# Altium schematic sheet WheelMotor.SchDoc
size A4
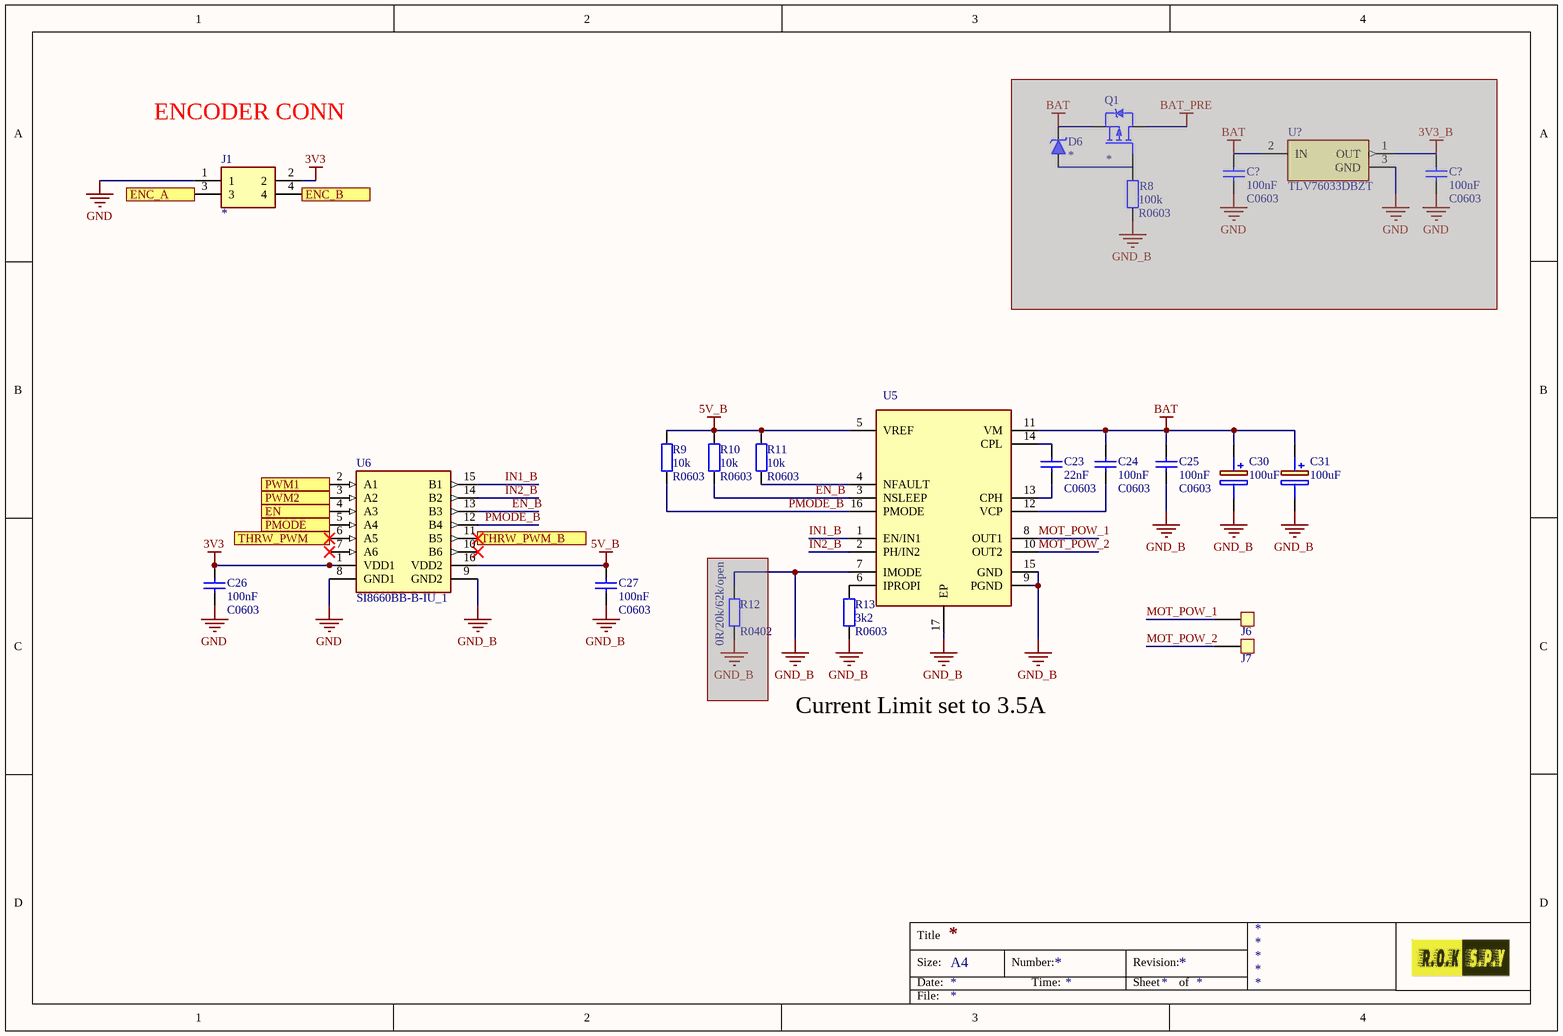
[diagram p0: WheelMotor.SchDoc]

## Parts
(Parts that share a designator on the sheet are numbered #1, #2 ... from top to bottom, then left to right.)
C23  Capacitance: 22nF  [C0603]
C24  Capacitance: 100nF  [C0603]
C25  Capacitance: 100nF  [C0603]
C26  Capacitance: 100nF  [C0603]
C27  Capacitance: 100nF  [C0603]
C30  100uF  [CAPPRD250W55D630H1220]
C31  100uF  [CAPPRD250W55D630H1220]
C?#1  Capacitance: 100nF  [C0603]  (masked out: inside a compile mask, not in the netlist)
C?#2  Capacitance: 100nF  [C0603]  (masked out: inside a compile mask, not in the netlist)
D6  *  (masked out: inside a compile mask, not in the netlist)
J1  215079-4  [TE_215079-4]  (value not drawn)
J6  Connection_pad  [Wire_Pad]  (value not drawn)
J7  Connection_pad  [Wire_Pad]  (value not drawn)
Q1  *  (masked out: inside a compile mask, not in the netlist)
R8  100k  [R0603]  (masked out: inside a compile mask, not in the netlist)
R9  10k  [R0603]
R10  10k  [R0603]
R11  10k  [R0603]
R12  0R/20k/62k/open  [R0402]  (masked out: inside a compile mask, not in the netlist)
R13  3k2  [R0603]
U5  DRV8874PWPR  [SOP65P640X120-17N]  (value not drawn)
U6  SI8660BB-B-IU_1  [SOP64P600X175-16N]
U?  TLV76033DBZT  [SOT23]  (masked out: inside a compile mask, not in the netlist)

## Ports
EN (in), ENC_A (out), ENC_B (out), PMODE (in), PWM1 (in), PWM2 (in), THRW_PWM (in), THRW_PWM_B (out)

## Nets
3V3: C26.2 J1.2 U6.1(VDD1)
5V_B: C27.2 R9.2 R10.2 R11.2 U5.5(VREF) U6.16(VDD2)
BAT: C24.2 C25.2 C30.1(+) C31.1(+) U5.11(VM)
GND: C26.1 J1.1 U6.8(GND1)
GND_B: C25.1 C27.1 C30.2(-) C31.2(-) R13.1 U5.7(IMODE) U5.9(PGND) U5.15(GND) U5.17(EP) U6.9(GND2)
EN: U6.4(A3) ; port EN
EN_B: R10.1 U5.3(NSLEEP) U6.13(B3)
ENC_A: J1.3 ; port ENC_A
ENC_B: J1.4 ; port ENC_B
IN1_B: U5.1(EN/IN1) U6.15(B1)
IN2_B: U5.2(PH/IN2) U6.14(B2)
MOT_POW_1: J6.1 U5.8(OUT1)
MOT_POW_2: J7.1 U5.10(OUT2)
PMODE: U6.5(A4) ; port PMODE
PMODE_B: R9.1 U5.16(PMODE) U6.12(B4)
PWM1: U6.2(A1) ; port PWM1
PWM2: U6.3(A2) ; port PWM2
THRW_PWM: U6.6(A5) ; port THRW_PWM
THRW_PWM_B: U6.11(B5) ; port THRW_PWM_B
NetC23_1: C23.1 U5.13(CPH)
NetC23_2: C23.2 U5.14(CPL)
NetC24_1: C24.1 U5.12(VCP)
NetR11_1: R11.1 U5.4(NFAULT)
NetR13_2: R13.2 U5.6(IPROPI)

Not connected (* = marked no-connect by the designer): U6 7(A6)* 10(B6)*

## Notes on the sheet
- ENCODER CONN
- Current Limit set to 3.5A
- Title
- Size:
- Date:
- A4
- Number:
- Time:
- Revision:
- Sheet
- of
- File:

## Library data of the parts
C23-C27 C?#1 C?#2 = Capacitor: Ceramic capacitor; Type: MLCC; Voltage rating: *V; ComponentLinknDescription: Datasheet; Characteristic: *; Manufacturer: *; ComponentLinknURL: *; Note: C0603
C30 C31 = EEUFC1E101S: Capacitor Polarised; Datasheet Link: *; Height: *; Manufacturer_Name: *; Manufacturer_Part_Number: *; Capacitance: 100uF; Voltage Rating: *; Farnell Order Nr: *
D6 = Zenner Diode: PartNumber: *; Parameter 2: *; Parameter 3: *; Parameter 4: *; Farnell Order Nr: *; Zenner Voltage: *
J1 = 215079-4: 4 Position Receptacle Connector Through Hole; MF: TE Connectivity; Price: None; Availability: Unavailable; SnapEDA_Link: https://www.snapeda.com/parts/215079-4/TE%20Connectivity%20AMP%20Connectors/view-part/2366486/?ref=snap; EU_RoHS_Compliance: Compliant; Value: *; MP: 215079-4; TE_purchase_URL: https://www.te.com/usa-en/product-215079-4.html?te_bu=Cor&te_type=disp&te_campaign=seda_glo_cor-seda-global-disp-prtnr-fy19-seda-model-bom-cta_sma-317_1&elqCampaignId=32493; Package: SMD-6 Omron Electronics; Comment_1: *
Q1 = P-Channel MOSFET: PartNumber: *; GS breakdown Volt: *; Farnell Order Nr: *; DS Breakdown Volt: *; Drain Current: *; rDSon: *; Parameter 2: *; Parameter 3: *; Datasheet: *
R8-R13 = Resistor: Precision: *%; Voltage rating: *V; Temp coefficient: *ppm; Power rating: *mW; ComponentLinknDescription: Datasheet; Manufacturer: *; ComponentLinknURL: *
  R8: Resistance: 100k; Note: R0603
  R9-R11: Resistance: 10k; Note: R0603
  R12: Resistance: 0R/20k/62k/open; Note: R0402
  R13: Resistance: 3k2; Note: R0603
U5 = DRV8874PWPR: DRV8874H-BridgeMotorDriverWith IntegratedCurrentSenseand Regulation; Manufacturer_Name: Texas Instruments; Datasheet Link: https://www.ti.com/lit/gpn/DRV8874; Height: 1.2mm; Manufacturer_Part_Number: DRV8874PWPR; ComponentLink1Description: Datasheet; ComponentLink1URL: https://www.ti.com/lit/gpn/DRV8874
U6 = SI8660: Low Power Six-Channel Digital Isolator; Manufacturer_Name: Silicon Labs; Manufacturer_Part_Number: SI8661BB-B-IU; Datasheet Link: https://componentsearchengine.com//SI8661BB-B-IU.pdf; Height: 1.75mm; Mouser2 Part Number: 634-SI8661BB-B-IU; Mouser2 Price/Stock: https://www.mouser.com/Search/Refine.aspx?Keyword=634-SI8661BB-B-IU; ComponentLink1Description: Datasheet; ComponentLink1URL: https://4donline.ihs.com/images/VipMasterIC/IC/SILC/SILC-S-A0009375737/SILC-S-A0009375737-1.pdf?hkey=6D3A4C79FDBF58556ACFDE234799DDF0; Farnell Order Nr: 2423337; PartNumber: SI8660BB-B-IU_1
U? = TLV760: 100-mA,30-V, Fixed-Output,Linear-VoltageRegulator; Manufacturer_Name: Texas Instruments; Datasheet Link: http://www.ti.com/lit/ds/symlink/tlv760.pdf; Height: 0.95mm; Manufacturer_Part_Number: TLV76033DBZT; PartNumber: TLV76033DBZT; Farnell Order Nr: 3007803; ComponentLink1Description: Datasheet; ComponentLink1URL: https://www.ti.com/lit/ds/symlink/tlv760.pdf?HQS=TI-null-null-mousermode-df-pf-null-wwe&DCM=yes&ref_url=https%3A%2F%2Feu.mouser.com%2F&distId=26